# EAGLE schematic Example_A (EAGLE 8.2.1)

## Sheet 1 of 2
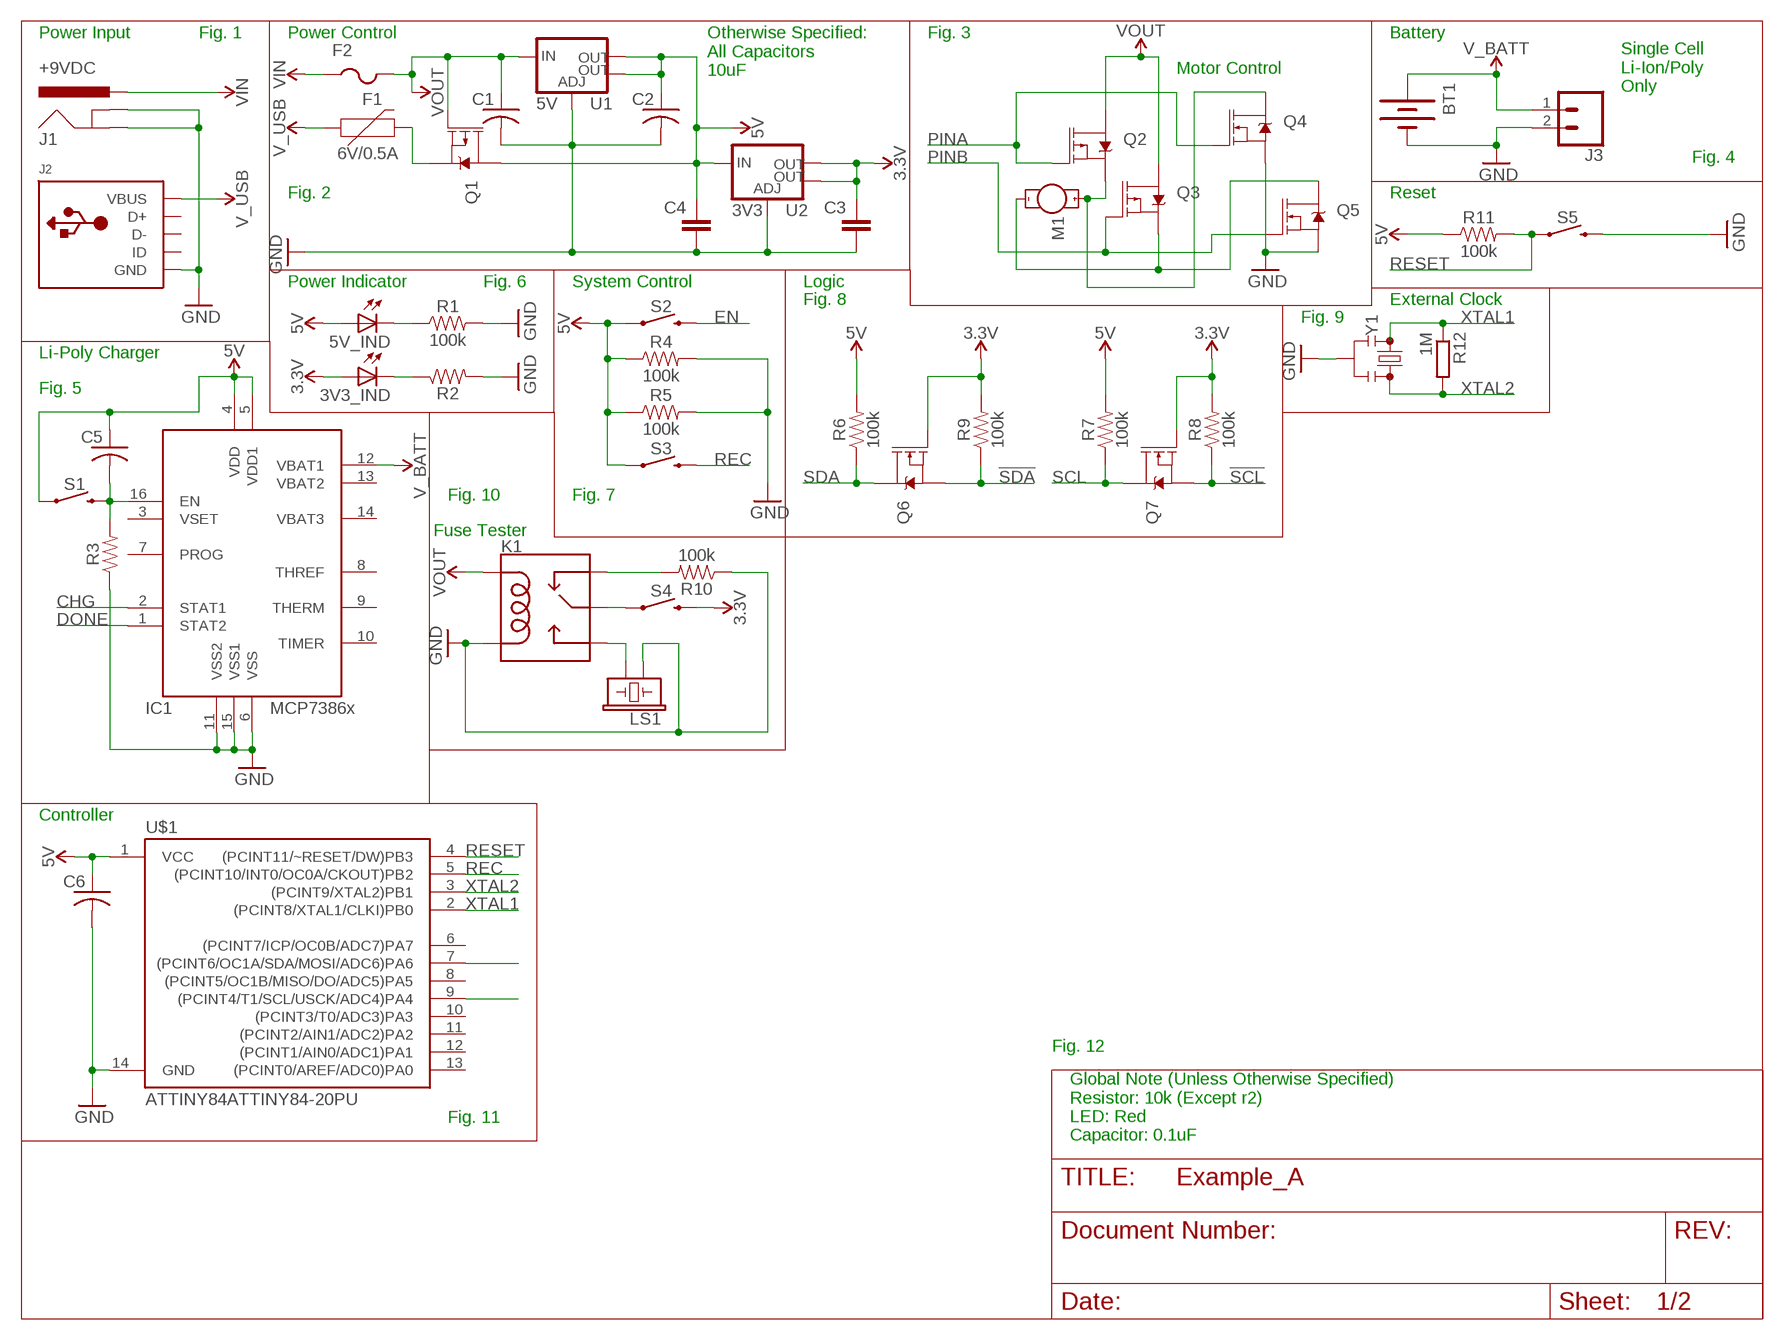
[diagram p0: schematic, sheet 1]

### Parts
3V3_IND  LEDCHIP-LED0805  [CHIP-LED0805]
5V_IND  LEDCHIP-LED0805  [CHIP-LED0805]
BT1  BATTERYFOB  [BATTERY_20MM_PTH_COMPACT]
C1  C-USC0805  [C0805]
C2  C-USC0805  [C0805]
C3  C-EUC0805  [C0805]
C4  C-EUC0805  [C0805]
C5  C-USC0805  [C0805]
C6  C-USC0805  [C0805]
F1  6V/0.5A  PPTC_HALF-AMP  [1206]
F2  PTCFUSE-1206  [R1206]
IC1  MCP7386XS  [SO16]
J1  +9VDC  POWER_JACKSMD  [POWER_JACK_SMD]
J2  USBMINIB  [USB-MINIB]
J3  CONN_023.5MM_LOCK  [SCREWTERMINAL-3.5MM-2_LOCK]
K1  RELAY-SPDT-JZC-11F  [RELAY-JZC]
LS1  BUZZER-PTH  [BUZZER-12MM]
M1  MOTOR10MM  [VIBE-MOTOR-10MM]
Q1  MOSFET_PCH-SI2309DS  [SOT23-3]
Q2  MOSFET_PCH-SI2309DS  [SOT23-3]
Q3  MOSFET_PCH-SI2309DS  [SOT23-3]
Q4  MOSFET-NCH-PSMN7R0  [TO-263/D2PAK]
Q5  MOSFET-NCH-PSMN7R0  [TO-263/D2PAK]
Q6  MOSFET-NCH-FQP30N06L  [TO220V]
Q7  MOSFET-NCH-FQP30N06L  [TO220V]
R1  100k  RESISTOR0805  [0805]
R2  RESISTOR0805  [0805]
R3  RESISTOR0805  [0805]
R4  100k  RESISTOR0805  [0805]
R5  100k  RESISTOR0805  [0805]
R6  100k  RESISTOR0805  [0805]
R7  100k  RESISTOR0805  [0805]
R8  100k  RESISTOR0805  [0805]
R9  100k  RESISTOR0805  [0805]
R10  100k  RESISTOR0805  [0805]
R11  100k  RESISTOR0805  [0805]
R12  1M  R-EU_R0805  [R0805]
S1  MOMENTARY-SWITCH-SPST-SMD-RIGHT-ANGLE  [TACTILE_SWITCH_SMD_RIGHT_ANGLE]
S2  MOMENTARY-SWITCH-SPST-SMD-RIGHT-ANGLE  [TACTILE_SWITCH_SMD_RIGHT_ANGLE]
S3  MOMENTARY-SWITCH-SPST-SMD-RIGHT-ANGLE  [TACTILE_SWITCH_SMD_RIGHT_ANGLE]
S4  MOMENTARY-SWITCH-SPST-SMD-RIGHT-ANGLE  [TACTILE_SWITCH_SMD_RIGHT_ANGLE]
S5  MOMENTARY-SWITCH-SPST-SMD-RIGHT-ANGLE  [TACTILE_SWITCH_SMD_RIGHT_ANGLE]
U1  5V  V_REG_LM1117SOT223  [SOT223]
U2  3V3  V_REG_LM1117SOT223  [SOT223]
U$1  ATTINY84ATTINY84-20PU  [DIP14]
Y1  RESONATORSMD-7.4X3.4  [RESONATOR-SMD-7.4X3.4]

### Nets
3.3V: 3V3_IND.A C3.1 Q6.1(G) Q7.1(G) R8.2 R9.2 S4.2 U2.2(OUT) U2.4(OUT)
5V: 5V_IND.A C2.1 C4.1 C5.1 C6.1 IC1.4(VDD) IC1.5(VDD1) Q1.3(D) R4.1 R5.1 R6.2 R7.2 R11.1 S1.1 S2.1 S3.1 U1.2(OUT) U1.4(OUT) U2.3(IN) U$1.1(VCC)
!SCL: Q7.3(S) R8.1
!SDA: Q6.3(S) R9.1
CHG: IC1.2(STAT1)
DONE: IC1.1(STAT2)
EN: S2.2
GND: BT1.2(-) C1.2 C2.2 C3.2 C4.2 C6.2 IC1.6(VSS) IC1.11(VSS2) IC1.15(VSS1) J1.GND(GNDBREAK) J1.P$4(GND) J2.GND J3.2 K1.1(COIL2) LS1.+ Q4.3(S) Q5.3(S) R1.2 R2.2 R3.1 R4.2 R5.2 R10.1 S5.2 U1.1(ADJ) U2.1(ADJ) U$1.14(GND) Y1.2
N$1: 3V3_IND.C R2.1
N$2: F1.2 Q1.2(S)
N$3: 5V_IND.C R1.1
N$4: M1.+ Q2.2(S) Q4.2(D)
N$5: K1.2(NC) R10.2
N$6: C5.2 IC1.16(EN) R3.2 S1.2
N$7: K1.3(NO) LS1.-
N$8: M1.- Q3.2(S) Q5.2(D)
N$9: K1.4(MAIN) S4.1
N$10: U$1.7((PCINT6/OC1A/SDA/MOSI/ADC6)PA6)
N$11: U$1.9((PCINT4/T1/SCL/USCK/ADC4)PA4)
PINA: Q2.1(G) Q4.1(G)
PINB: Q3.1(G) Q5.1(G)
REC: S3.2 U$1.5((PCINT10/INT0/OC0A/CKOUT)PB2)
RESET: R11.2 S5.1 U$1.4((PCINT11/~RESET/DW)PB3)
SCL: Q7.2(D) R7.1
SDA: Q6.2(D) R6.1
V_BATT: BT1.1(+) IC1.12(VBAT1) J3.1
V_USB: F1.1 J2.VBUS
VIN: F2.1 J1.VIN0(PWR)
VOUT: C1.1 F2.2 K1.5(COIL1) Q1.1(G) Q2.3(D) Q3.3(D) U1.3(IN)
XTAL1: R12.1 U$1.2((PCINT8/XTAL1/CLKI)PB0) Y1.1
XTAL2: R12.2 U$1.3((PCINT9/XTAL2)PB1) Y1.3
Unconnected: IC1.3(VSET) IC1.7(PROG) IC1.8(THREF) IC1.9(THERM) IC1.10(TIMER) IC1.13(VBAT2) IC1.14(VBAT3) J2.D+ J2.D- J2.ID U$1.6((PCINT7/ICP/OC0B/ADC7)PA7) U$1.8((PCINT5/OC1B/MISO/DO/ADC5)PA5) U$1.10((PCINT3/T0/ADC3)PA3) U$1.11((PCINT2/AIN1/ADC2)PA2) U$1.12((PCINT1/AIN0/ADC1)PA1) U$1.13((PCINT0/AREF/ADC0)PA0)

### Notes on the sheet
- Power Input | Fig. 1 | Power Control | Fig. 3 | Battery
- Motor Control
- Otherwise Specified:
  All Capacitors
  10uF
- Single Cell
  Li-Ion/Poly
  Only
- Fig. 4
- Fig. 2 | Reset
- Power Indicator | Fig. 6 | System Control | Logic
- Fig. 8 | External Clock
- Fig. 9
- Li-Poly Charger
- Fig. 5
- Fig. 10 | Fig. 7
- Fuse Tester
- Controller
- Fig. 12
- Fig. 11
- Global Note (Unless Otherwise Specified)
  Resistor: 10k (Except r2)
  LED: Red
  Capacitor: 0.1uF

## Sheet 2 of 2
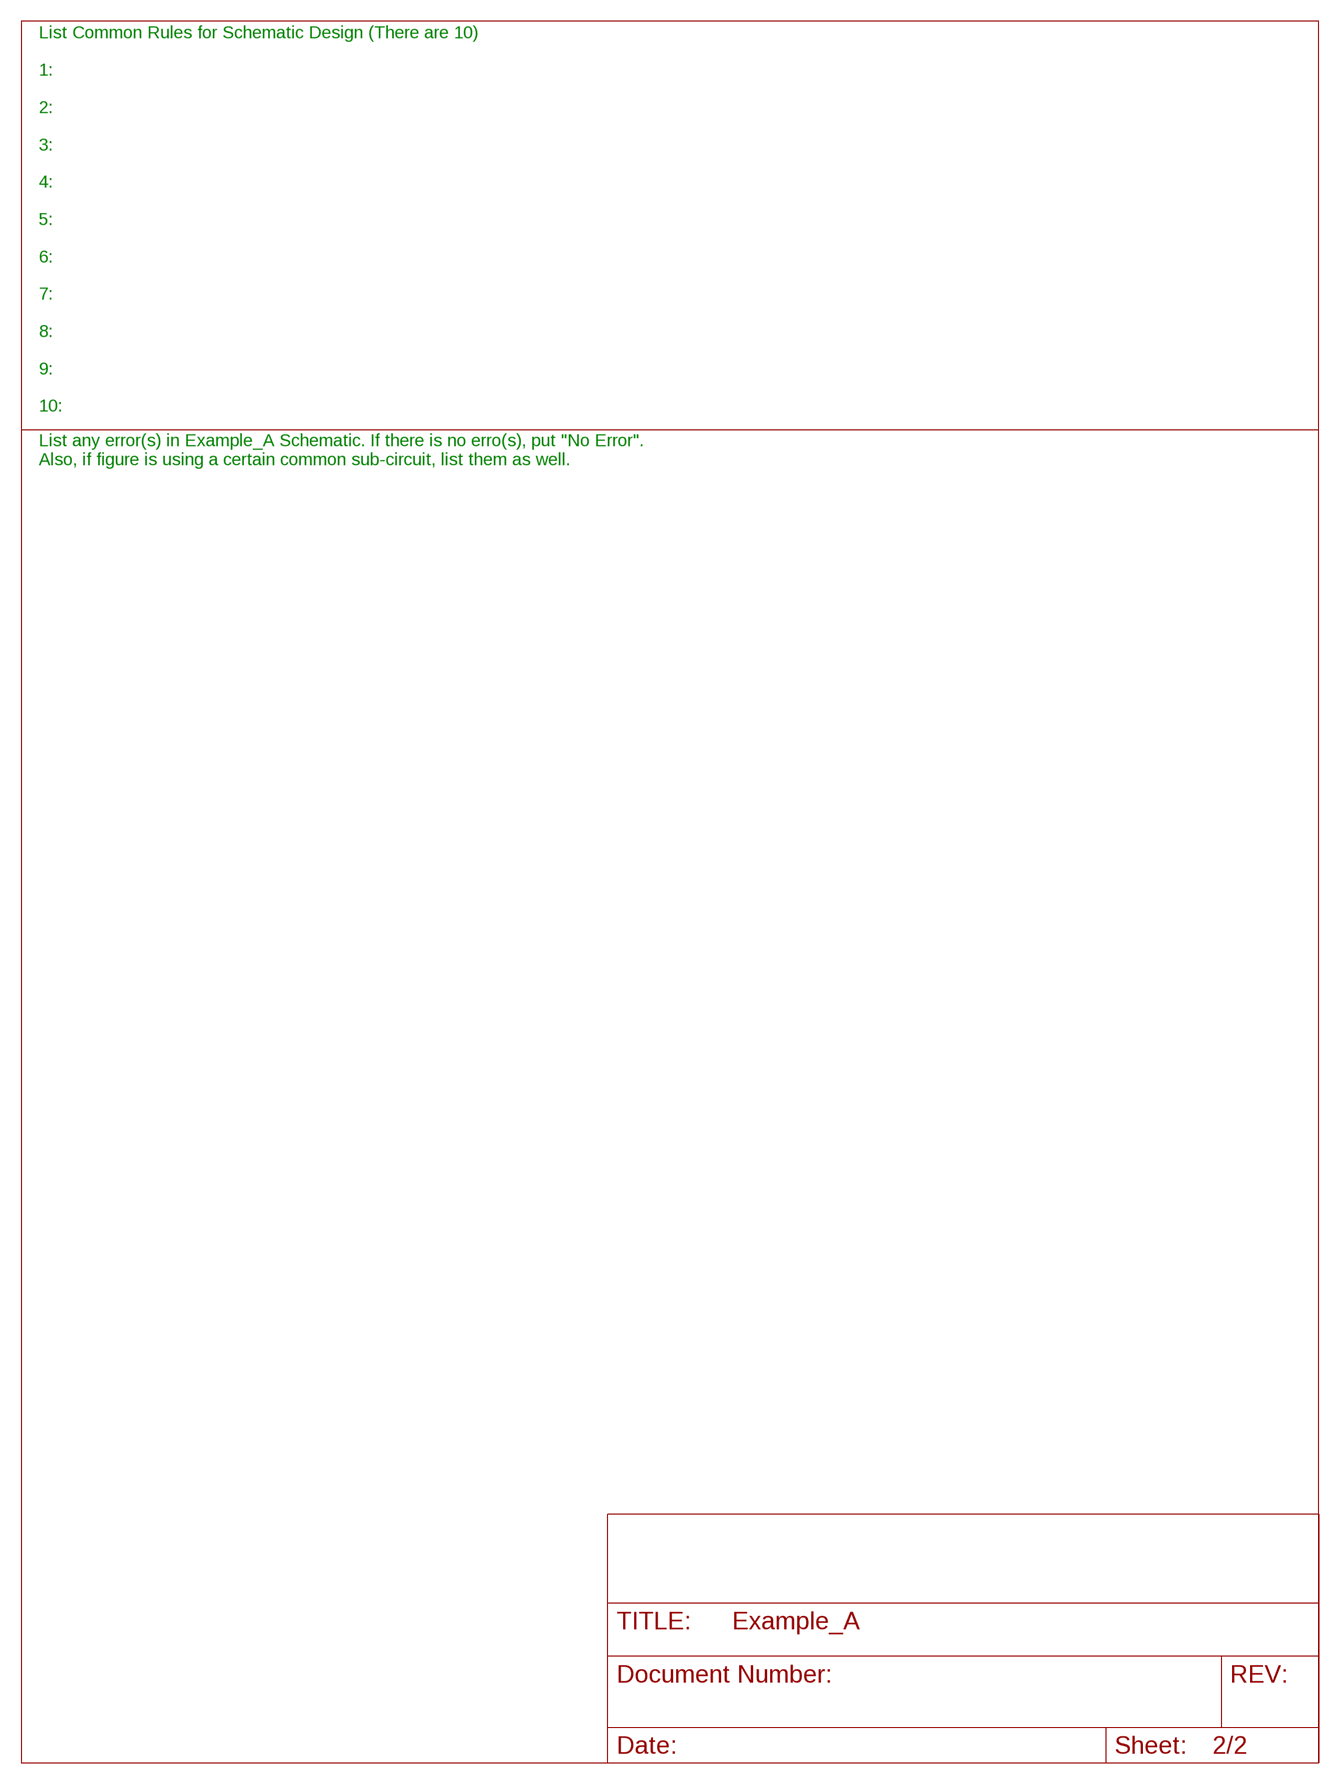
[diagram p1: schematic, sheet 2]

### Notes on the sheet
- List Common Rules for Schematic Design (There are 10)
- 1:
  
  2:
  
  3:
  
  4:
  
  5:
  
  6:
  
  7:
  
  8:
  
  9:
  
  10:
- List any error(s) in Example_A Schematic. If there is no erro(s), put "No Error".
  Also, if figure is using a certain common sub-circuit, list them as well.

## Library data of the parts
3V3_IND 5V_IND = led:LED: LED OSRAM: - CHIPLED LG R971, LG N971, LY N971, LG Q971, LY Q971, LO R971, LY R971 LH N974, LH R974 LS Q976, LO Q976, LY Q976 LO Q996 - Hyper CHIPLED LW Q18S LB Q993, LB Q99A, LB R99A - SideLED LS A670, LO A670, LY A670, LG A670, LP A670 LB A673, LV A673, LT A673, LW A673 LH A674 LY A675 LS A676, LA A676, LO A676, LY A676, LW A676 LS A679, LY A679, LG A679 - Hyper Micro SIDELED® LS Y876, LA Y876, LO Y876, LY Y876 LT Y87S - SmartLED LW L88C, LW L88S LB L89C, LB L89S, LG L890 LS L89K, LO L89K, LY L89K LS L896, LA L896, LO L896, LY L896 - TOPLED LS T670, LO T670, LY T670, LG T670, LP T670 LSG T670, LSP T670, LSY T670, LOP T670, LYG T670 LG T671, LOG T671, LSG T671 LB T673, LV T673, LT T673, LW T673 LH T674 LS T676, LA T676, LO T676, LY T676, LB T676, LH T676, LSB T676, LW T676 LB T67C, LV T67C, LT T67C, LS T67K, LO T67K, LY T67K, LW E67C LS E67B, LA E67B, LO E67B, LY E67B, LB E67C, LV E67C, LT E67C LW T67C LS T679, LY T679, LG T679 LS T770, LO T770, LY T770, LG T770, LP T770 LB T773, LV T773, LT T773, LW T773 LH T774 LS E675, LA E675, LY E675, LS T675 LS T776, LA T776, LO T776, LY T776, LB T776 LHGB T686 LT T68C, LB T68C - Hyper Mini TOPLED® LB M676 - Mini TOPLED Santana® LG M470 LS M47K, LO M47K, LY M47K Source: http://www.osram.convergy.de LUXEON: - LUMILED® LXK2-PW12-R00, LXK2-PW12-S00, LXK2-PW14-U00, LXK2-PW14-V00 LXK2-PM12-R00, LXK2-PM12-S00, LXK2-PM14-U00 LXK2-PE12-Q00, LXK2-PE12-R00, LXK2-PE12-S00, LXK2-PE14-T00, LXK2-PE14-U00 LXK2-PB12-K00, LXK2-PB12-L00, LXK2-PB12-M00, LXK2-PB14-N00, LXK2-PB14-P00, LXK2-PB14-Q00 LXK2-PR12-L00, LXK2-PR12-M00, LXK2-PR14-Q00, LXK2-PR14-R00 LXK2-PD12-Q00, LXK2-PD12-R00, LXK2-PD12-S00 LXK2-PH12-R00, LXK2-PH12-S00 LXK2-PL12-P00, LXK2-PL12-Q00, LXK2-PL12-R00 Source: www.luxeon.com KINGBRIGHT: KA-3528ASYC Source: www.kingbright.com
BT1 = SparkFun-Retired:BATTERY: Battery - Single Cell A variety of battery chemistries, sizes, and footprints. Including AA, AAA, 18650 (PRT-12895), 20mm coin cell and 12mm coin cell. 20MM_4LEGS, BATT-10373
C1 C2 C5 C6 = rcl:C-US: CAPACITOR, American symbol
C3 C4 = rcl:C-EU: CAPACITOR, European symbol
F1 = SparkFun-Fuses:PPTC: Resettable Fuse PPTC Resettable Fuse. Really a sort of resistor with a polymeric positive temperature coefficient whose resistance increases dramatically with an increase in temperature. When heated by the power passing through the resistance rises causing the current to be limited, protecting the circuit. This is achieved by the transition of the polymer from a crystalline to an amorphous state where the conductive carbon separates breaking the conductive pathways found in the cool crystalline structure. When a PPTC cools back down it resumes conducting letting the circuit turn back on. SparkFun Products: SparkFun RedBoard - Programmed with Arduino <https://www.sparkfun.com/products/12757> Pro Micro - 5V/16MHz <https://www.sparkfun.com/products/12640> Arduino Pro 328 - 5V/16MHz <https://www.sparkfun.com/products/10915> MP3 Trigger <https://www.sparkfun.com/products/13720>; PROD_ID: RES-08585
F2 = adafruit:PTCFUSE: PTC fuses, resettable thermistors
IC1 = adafruit:MCP7386X: MCP7386x 4.1, 4.2, 8.2, 8.4 LiPoly battery charger chip family, with wide DC input, thermal cutoff, adjustable curret, and indicator LEDs
J1 = SparkFun-Connectors:POWER_JACK: Power Jack Connector This is the standard 5.5mm barrel jack for power. The PTH is the most common, proven, reliable, footprint. The Slot footprint only works if the mill layer is transmitted to the PCB fab house so be warned. Here are the connectors we sell at SparkFun: DC Barrel Power Jack/Connector <https://www.sparkfun.com/products/119> (PRT-00119) DC Barrel Power Jack/Connector (SMD) <https://www.sparkfun.com/products/12748> (PRT-12748) DC Barrel Jack Adapter - Breadboard Compatible <https://www.sparkfun.com/products/10811> (PRT-10811) It is used on this SparkFun product (and many, many others): SparkFun RedBoard - Programmed with Arduino <https://www.sparkfun.com/products/12757> (DEV-12757) Also, if you need a mating power supply or connector, please check these out: Wall Adapter Power Supply - 9VDC 650mA <https://www.sparkfun.com/products/298> (TOL-00298) DC Barrel Jack Adapter - Male <https://www.sparkfun.com/products/10287> (PRT-10287); PROD_ID: CONN-08106; SF_ID: PRT-12748; VALUE: 5.5x2.1mm Barrel
J2 = adafruit:USB: USB Connectors USBMINIB - Surface Mount Female Mini-B USB Connector 4UConnector: 06564 By microbuilder.eu Thru-hole RA Female Mini-B USB Connector 4UConnector: 18732 By ladyada.net
J3 = SparkFun-Connectors:CONN_02: Multi connection point. Often used as Generic Header-pin footprint for 0.1 inch spaced/style header connections On any of the 0.1 inch spaced packages, you can populate with these: Break Away Headers - Straight <https://www.sparkfun.com/products/116> (PRT-00116) Break Away Male Headers - Right Angle <https://www.sparkfun.com/products/553> (PRT-00553) Female Headers <https://www.sparkfun.com/products/115> (PRT-00115) Break Away Headers - Machine Pin <https://www.sparkfun.com/products/117> (PRT-00117) Break Away Female Headers - Swiss Machine Pin <https://www.sparkfun.com/products/743> (PRT-00743) For SCREWTERMINALS and SPRING TERMINALS visit here: Screw Terimnals on SparkFun.com <https://www.sparkfun.com/search/results?term=Screw+Terminals> (5mm/3.5mm/2.54mm spacing) This device is also useful as a general connection point to wire up your design to another part of your project. Our various solder wires solder well into these plated through hole pads. Hook-Up Wire - Assortment (Stranded, 22 AWG) <https://www.sparkfun.com/products/11375> (PRT-11375) Hook-Up Wire - Assortment (Solid Core, 22 AWG) <https://www.sparkfun.com/products/11367> (PRT-11367) View the entire wire category on our website here <https://www.sparkfun.com/categories/141> Special notes: Molex polarized connector foot print use with: PRT-08233 with associated crimp pins and housings. 2.54_SCREWTERM for use with PRT-10571. 3.5mm Screw Terminal footprints for PRT-08084 5mm Screw Terminal footprints for use with PRT-08432; PROD_ID: CONN-08399
K1 = SparkFun-Electromechanical:RELAY-SPDT: SPDT Electromechanical Relay Single-pole, double-throw sealed relays. When current is applied to the coil, it throws a simple changeover switch, terminating the connection from the NC contact to ground and closing the NO contact. Use them to switch high voltage/high current devices. SparkFun Products JQX-15F: Relay SPDT Sealed - 20A <https://www.sparkfun.com/products/10924> (COM-10924) JZC-11F: Relay SPDT Sealed <https://www.sparkfun.com/products/100> (COM-00100); PROD_ID: COMP-09533; SF_SKU: COM-00100
LS1 = SparkFun-Electromechanical:BUZZER: Buzzer Small round buzzers that operate around the audible 2kHz range. You can use these as speakers to create simple music or user interfaces. Variant Overview: PTH - Mini Speaker - PC Mount 12mm 2.048kHz <https://www.sparkfun.com/products/7950> PTH_KIT - Mini Speaker - PC Mount 12mm 2.048kHz <https://www.sparkfun.com/products/7950> KIT simplifies soldering by adding stop mask to one side of the pads. PTH_NO_SILK - Mini Speaker - PC Mount 12mm 2.048kHz <https://www.sparkfun.com/products/7950> No silkscreen indicator of buzzer outline. PTH_KIT_NO_SILK - Mini Speaker - PC Mount 12mm 2.048kHz <https://www.sparkfun.com/products/7950> KIT package w/o silkscreen SMD - Buzzer Audio Magnetic (CCV-084B16) SMD buzzer used on, e.g. the LilyPad Buzzer <https://www.sparkfun.com/products/8463> and RFID USB Reader <https://www.sparkfun.com/products/9963>. SMD_KIT - Buzzer Audio Magnetic (CCV-084B16) SMD Buzzer with elongated pins to make soldering easier. Used on the SparkFun Simon Says - Surface Mount Soldering Kit <https://www.sparkfun.com/products/10935>.; PROD_ID: COMP-08253; SF_SKU: COM-07950
M1 = SparkFun-Electromechanical:MOTOR: Motor (Single-Phase) Two-terminal, single-phase motors. SparkFun Products Vibration Motor <https://www.sparkfun.com/products/8449> (ROB-08449) Physical dimension and wire connections for this powerful vibration motor. Motor has a self adhesive backing.; PROD_ID: COMP-08572; SF_SKU: ROB-08449
Q1-Q3 = SparkFun-DiscreteSemi:MOSFET_PCH: P-channel MOSFETs Voltage controlled devices that allow control of high current outputs. SparkFun Products: SparkFun ESP32 Thing <https://www.sparkfun.com/products/13907> SparkFun ESP8266 Thing <https://www.sparkfun.com/products/13231>; PROD_ID: TRANS-08285; VALUE: 1.1A/60V/600mΩ
Q4 Q5 = SparkFun-DiscreteSemi:MOSFET-NCH: N-channel MOSFETs Voltage controlled devices that allow control of high current outputs. SparkFun Products: SparkFun OpenScale <https://www.sparkfun.com/products/13261> SparkFun Digital Sandbox <https://www.sparkfun.com/products/12651> SparkFun Monster Moto Shield <https://www.sparkfun.com/products/10182> SparkFun MOSFET Power Controller <https://www.sparkfun.com/products/11214>; PROD_ID: TRANS-12437; VALUE: 100A/100V/6.8mΩ
Q6 Q7 = SparkFun-DiscreteSemi:MOSFET-NCH: N-channel MOSFETs Voltage controlled devices that allow control of high current outputs. SparkFun Products: SparkFun OpenScale <https://www.sparkfun.com/products/13261> SparkFun Digital Sandbox <https://www.sparkfun.com/products/12651> SparkFun Monster Moto Shield <https://www.sparkfun.com/products/10182> SparkFun MOSFET Power Controller <https://www.sparkfun.com/products/11214>; PROD_ID: TRANS-10060; VALUE: 60V/32A/35mΩ
R1-R11 = SparkFun-Resistors:RESISTOR: Generic Resistor Package
R12 = rcl:R-EU_: RESISTOR, European symbol
S1-S5 = SparkFun-Switches:MOMENTARY-SWITCH-SPST: Momentary Switch (Pushbutton) - SPST Normally-open (NO) SPST momentary switches (buttons, pushbuttons). Variants PTH-12MM - 12mm square, through-hole Momentary Pushbutton Switch - 12mm Square <https://www.sparkfun.com/products/9190> (COM-09190) PTH-6.0MM, PTH-6.0MM-KIT - 6.0mm square, through-hole Mini Pushbutton Switch <https://www.sparkfun.com/products/97> (COM-00097) KIT package intended for soldering kit's - only one side of pads' copper is exposed. PTH-RIGHT-ANGLE-KIT - Right-angle, through-hole Right Angle Tactile Button <https://www.sparkfun.com/products/10791> - Used on SparkFun BigTime Watch Kit <https://www.sparkfun.com/products/11734> SMD-12MM - 12mm square, surface-mount Tactile Button - SMD (12mm) <https://www.sparkfun.com/products/12993> (COM-12993) Used on SparkFun PicoBoard <https://www.sparkfun.com/products/11888> SMD-4.5MM - 4.5mm Square Trackball Switch Used on SparkFun Blackberry Trackballer Breakout <https://www.sparkfun.com/products/13169> SMD-4.6MMX2.8MM - 4.60mm x 2.80mm, surface mount Used on SparkFun SAMD21 Mini Breakout <https://www.sparkfun.com/products/13664> SMD-5.2MM, SMD-5.2-REDUNDANT - 5.2mm square, surface-mount Mini Pushbutton Switch - SMD <https://www.sparkfun.com/products/8720> (COM-08720) Used on Arduino Pro Mini <https://www.sparkfun.com/products/11114> REDUNDANT package connects both switch circuits together SMD-6.0X3.5MM - 6.0 x 3.5mm, surface mount Momentary Reset Switch SMD <https://www.sparkfun.com/products/8229> (COM-08229) SMD-6.2MM-TALL - 6.2mm square, surface mount Tactile Button - SMD (6mm) <https://www.sparkfun.com/products/12992> Used on SparkFun Digital Sandbox <https://www.sparkfun.com/products/12651> SMD-RIGHT-ANGLE - Right-angle, surface mount Used on SparkFun Block for Intel® Edison - Arduino <https://www.sparkfun.com/products/13036>; PROD_ID: COMP-12265
U1 U2 = SparkFun-IC-Power:V_REG_LM1117: Voltage Regulator LM1117 Standard adjustable voltage regulator but in SMD form. Spark Fun Electronics SKU : COM-00595; PROD_ID: VREG-08170
U$1 = SparkFun-IC-Microcontroller:ATTINY84: Atmel 14-pin 2/4/8kB flash uC Datasheet <https://cdn.sparkfun.com/datasheets/Widgets/doc8006.pdf> SparkFun Products Tiny AVR Programmer <https://www.sparkfun.com/products/11801> (PGM-11801) SparkFun Servo Trigger - Continuous Rotation <https://www.sparkfun.com/products/13872> (WIG-13872) SparkFun Servo Trigger <https://www.sparkfun.com/products/13118> (WIG-13118)
Y1 = SparkFun-Clocks:RESONATOR: Resonators (Generic) Ceramic resonators are clock-generating components, often used to control timing in microcontrollers. They usually have 3 pins: two pins for oscillation, and one pin for ground. Compared to crystals, resonators have worse tolerance, but are usually much cheaper. Plus, they have built-in load capacitors! These devices are used on boards like the Arduino Pro 8MHz <https://www.sparkfun.com/products/11114> and Arduino Pro 16MHz <https://www.sparkfun.com/products/11113>.